# EAGLE schematic megashield schematic (EAGLE 7.5.0)
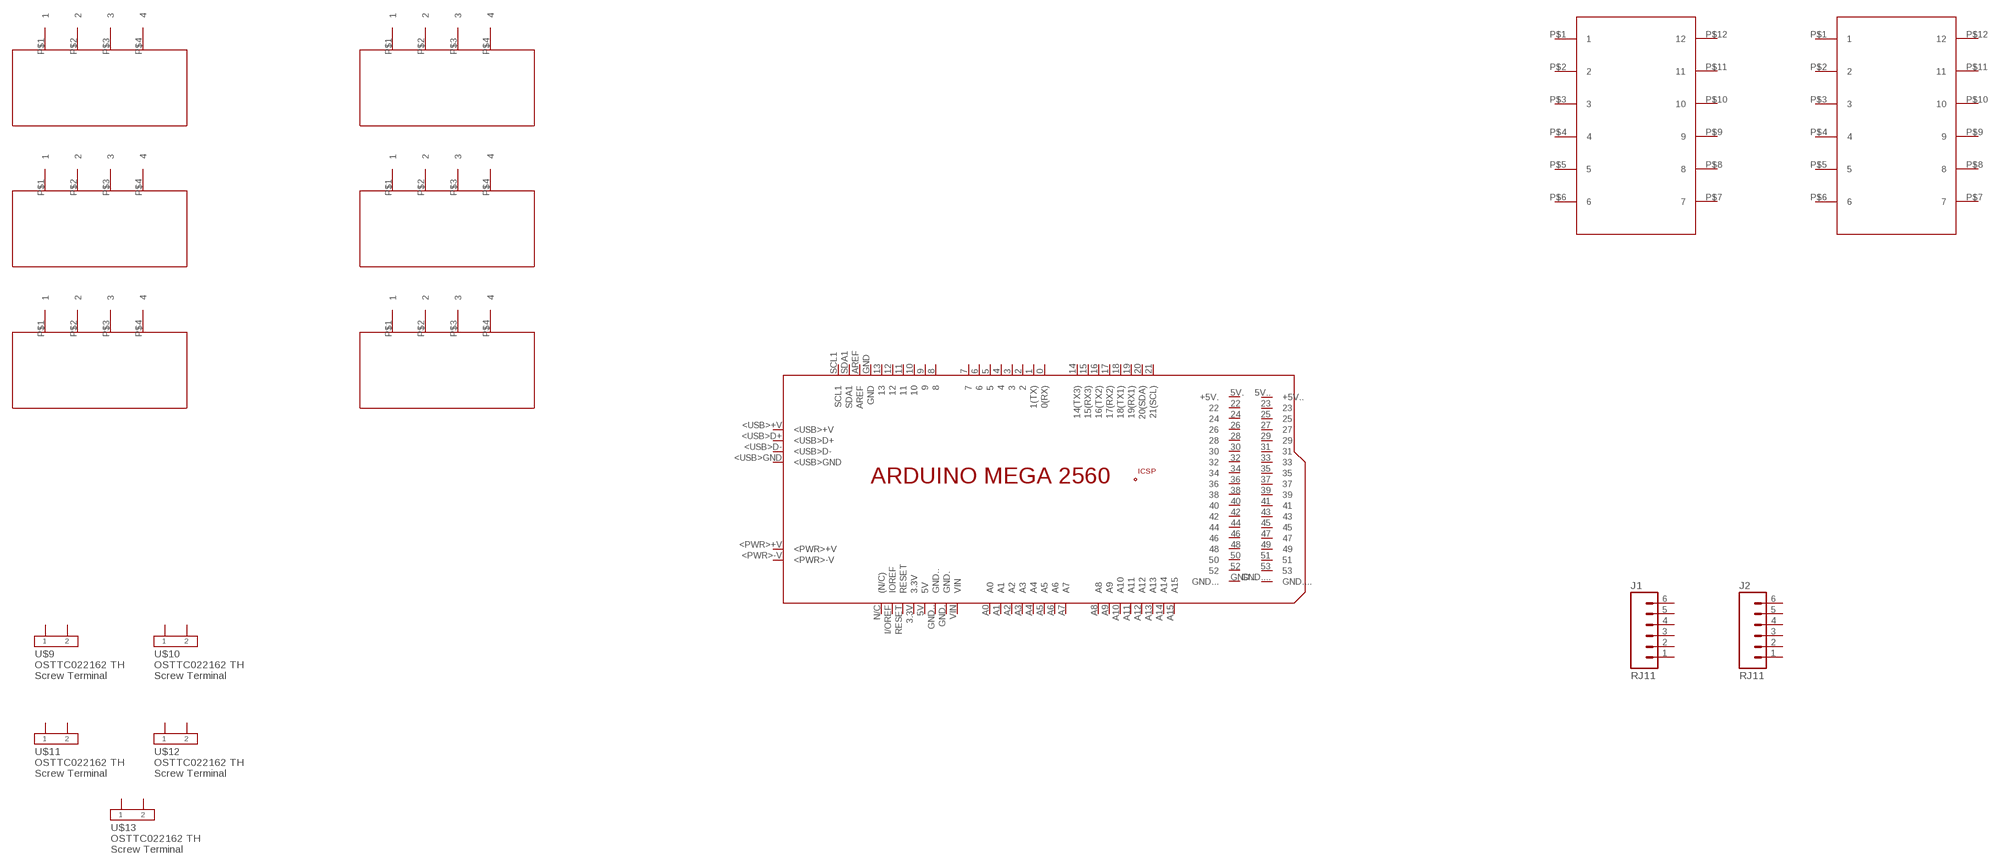
[diagram p0: schematic, sheet 1]

## Parts
J1  RJ11  RJ11-6PTH  [RJ11-6]
J2  RJ11  RJ11-6PTH  [RJ11-6]
PCB1  ARDUINO_MEGA2560  [ARDUINO_MEGA2560]
U$1  12PIN_TERMINAL_BLOCK  [12PIN_TERMINAL_BLOCK]
U$2  12PIN_TERMINAL_BLOCK  [12PIN_TERMINAL_BLOCK]
U$3  4PIN-CONNECTOR4  [4-POSITION-TERMINAL-BLOCK]
U$4  4PIN-CONNECTOR4  [4-POSITION-TERMINAL-BLOCK]
U$5  4PIN-CONNECTOR4  [4-POSITION-TERMINAL-BLOCK]
U$6  4PIN-CONNECTOR4  [4-POSITION-TERMINAL-BLOCK]
U$7  4PIN-CONNECTOR4  [4-POSITION-TERMINAL-BLOCK]
U$8  4PIN-CONNECTOR4  [4-POSITION-TERMINAL-BLOCK]
U$9  OSTTC022162_TH  [P1]
U$10  OSTTC022162_TH  [P1]
U$11  OSTTC022162_TH  [P1]
U$12  OSTTC022162_TH  [P1]
U$13  OSTTC022162_TH  [P1]
Unconnected: J1.1 J1.2 J1.3 J1.4 J1.5 J1.6 J2.1 J2.2 J2.3 J2.4 J2.5 J2.6 PCB1.0(0(RX)) PCB1.1(1(TX)) PCB1.2 PCB1.3 PCB1.3.3V PCB1.4 PCB1.5 PCB1.5V PCB1.5V.(+5V.) PCB1.5V..(+5V..) PCB1.6 PCB1.7 PCB1.8 PCB1.9 PCB1.10 PCB1.11 PCB1.12 PCB1.13 PCB1.14(14(TX3)) PCB1.15(15(RX3)) PCB1.16(16(TX2)) PCB1.17(17(RX2)) PCB1.18(18(TX1)) PCB1.19(19(RX1)) PCB1.20(20(SDA)) PCB1.21(21(SCL)) PCB1.22 PCB1.23 PCB1.24 PCB1.25 PCB1.26 PCB1.27 PCB1.28 PCB1.29 PCB1.30 PCB1.31 PCB1.32 PCB1.33 PCB1.34 PCB1.35 PCB1.36 PCB1.37 PCB1.38 PCB1.39 PCB1.40 PCB1.41 PCB1.42 PCB1.43 PCB1.44 PCB1.45 PCB1.46 PCB1.47 PCB1.48 PCB1.49 PCB1.50 PCB1.51 PCB1.52 PCB1.53 PCB1.+5V_ PCB1.<PWR>+V PCB1.<PWR>-V PCB1.<USB>+V PCB1.<USB>D+ PCB1.<USB>D- PCB1.<USB>GND PCB1.A0 PCB1.A1 PCB1.A2 PCB1.A3 PCB1.A4 PCB1.A5 PCB1.A6 PCB1.A7 PCB1.A8 PCB1.A9 PCB1.A10 PCB1.A11 PCB1.A12 PCB1.A13 PCB1.A14 PCB1.A15 PCB1.AREF PCB1.GND PCB1.GND. PCB1.GND.. PCB1.GND... PCB1.GND.... PCB1.GND__ PCB1.I/OREF(IOREF) PCB1.MISO PCB1.MOSI PCB1.N/C((N/C)) PCB1.RESET PCB1.RESET. PCB1.SCK PCB1.SCL1 PCB1.SDA1 PCB1.VIN U$1.P$1 U$1.P$2 U$1.P$3 U$1.P$4 U$1.P$5 U$1.P$6 U$1.P$7 U$1.P$8 U$1.P$9 U$1.P$10 U$1.P$11 U$1.P$12 U$2.P$1 U$2.P$2 U$2.P$3 U$2.P$4 U$2.P$5 U$2.P$6 U$2.P$7 U$2.P$8 U$2.P$9 U$2.P$10 U$2.P$11 U$2.P$12 U$3.P$1 U$3.P$2 U$3.P$3 U$3.P$4 U$4.P$1 U$4.P$2 U$4.P$3 U$4.P$4 U$5.P$1 U$5.P$2 U$5.P$3 U$5.P$4 U$6.P$1 U$6.P$2 U$6.P$3 U$6.P$4 U$7.P$1 U$7.P$2 U$7.P$3 U$7.P$4 U$8.P$1 U$8.P$2 U$8.P$3 U$8.P$4 U$9.P$1 U$9.P$2 U$10.P$1 U$10.P$2 U$11.P$1 U$11.P$2 U$12.P$1 U$12.P$2 U$13.P$1 U$13.P$2

## Library data of the parts
J1 J2 = SparkFun-Connectors:RJ11-6: RJ11 Jack Simple 6 pin RJ11 jack. Commonly found on CAT3 devices and Microchip programmers. SKU: PRT-00132; PROD_ID: CONN-08590
PCB1 = E14_Arduino_revC:ARDUINO_MEGA2560: Device for representing an Arduino Mega 2560 board with a footprint in an EAGLE design. Created by Dave Young for Element14. More EAGLE documentation at: http://www.element14.com/community/community/knode/cadsoft_eagle
U$1 U$2 = 12pinTerminalBlock:12PIN_TERMINAL_BLOCK
U$3-U$8 = 4pin connector:4PIN-CONNECTOR
U$9-U$13 = 2pinthruhole:OSTTC022162_TH